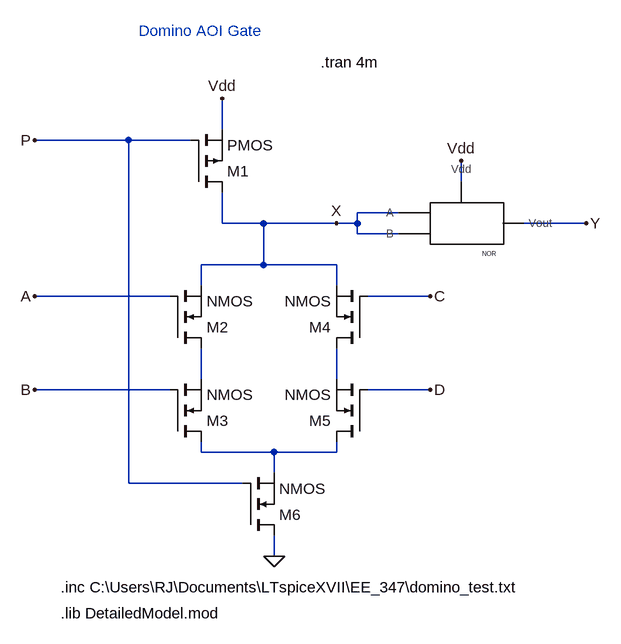
[diagram p0: schematic domino_aoi_gate.asc]
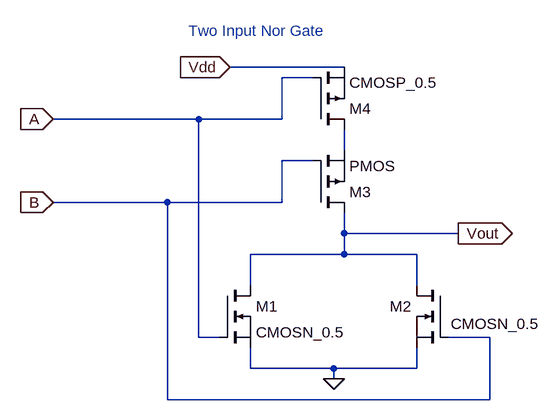
[diagram p1: sub-circuit my_nor.asc]
domino_aoi_gate.asc, the LTspice schematic file:
Version 4
SHEET 1 880 920
WIRE 256 160 256 112
WIRE 112 176 -32 176
WIRE 208 176 112 176
WIRE 624 240 624 208
WIRE 528 288 464 288
WIRE 256 304 256 256
WIRE 320 304 256 304
WIRE 432 304 320 304
WIRE 464 304 464 288
WIRE 464 304 432 304
WIRE 816 304 720 304
WIRE 464 320 464 304
WIRE 528 320 464 320
WIRE 320 368 320 304
WIRE 320 368 224 368
WIRE 432 368 320 368
WIRE 224 400 224 368
WIRE 432 400 432 368
WIRE 176 416 -32 416
WIRE 576 416 480 416
WIRE 224 544 224 496
WIRE 432 544 432 496
WIRE 176 560 -32 560
WIRE 576 560 480 560
WIRE 224 656 224 640
WIRE 336 656 224 656
WIRE 432 656 432 640
WIRE 432 656 336 656
WIRE 336 688 336 656
WIRE 112 704 112 176
WIRE 288 704 112 704
WIRE 336 816 336 784
FLAG -32 416 A
FLAG -32 560 B
FLAG 576 416 C
FLAG 576 560 D
FLAG 336 816 0
FLAG 432 304 X
FLAG 256 112 Vdd
FLAG -32 176 P
FLAG 624 208 Vdd
FLAG 816 304 Y
SYMBOL pmos 208 256 M180
SYMATTR InstName M1
SYMBOL nmos 176 496 M180
SYMATTR InstName M2
SYMBOL nmos 176 640 M180
SYMATTR InstName M3
SYMBOL nmos 480 496 R180
SYMATTR InstName M4
SYMBOL nmos 480 640 R180
SYMATTR InstName M5
SYMBOL nmos 288 784 M180
SYMATTR InstName M6
SYMBOL my_nor 624 304 R0
SYMATTR InstName NOR
TEXT 128 8 Left 2 ;Domino AOI Gate
TEXT 8 864 Left 2 !.inc C:\\Users\\RJ\\Documents\\LTspiceXVII\\EE_347\\domino_test.txt
TEXT 8 904 Left 2 !.lib DetailedModel.mod
TEXT 408 56 Left 2 !.tran 4m

my_nor.asc, the sub-circuit schematic file:
Version 4
SHEET 1 880 680
WIRE 336 -240 160 -240
WIRE 288 -224 240 -224
WIRE 112 -160 -112 -160
WIRE 240 -160 240 -224
WIRE 240 -160 112 -160
WIRE 336 -112 336 -144
WIRE 288 -96 240 -96
WIRE 64 -32 -112 -32
WIRE 240 -32 240 -96
WIRE 240 -32 64 -32
WIRE 336 16 336 -16
WIRE 512 16 336 16
WIRE 336 48 336 16
WIRE 336 48 192 48
WIRE 448 48 336 48
WIRE 192 96 192 48
WIRE 448 96 448 48
WIRE 112 176 112 -160
WIRE 144 176 112 176
WIRE 560 176 496 176
WIRE 192 224 192 192
WIRE 320 224 192 224
WIRE 448 224 448 192
WIRE 448 224 320 224
WIRE 320 240 320 224
WIRE 64 272 64 -32
WIRE 560 272 560 176
WIRE 560 272 64 272
FLAG -112 -32 B
IOPIN -112 -32 In
FLAG -112 -160 A
IOPIN -112 -160 In
FLAG 160 -240 Vdd
IOPIN 160 -240 In
FLAG 512 16 Vout
IOPIN 512 16 Out
FLAG 320 240 0
SYMBOL nmos 144 96 R0
SYMATTR InstName M1
SYMATTR Value CMOSN_0.5
SYMBOL nmos 496 96 M0
WINDOW 3 -141 59 Left 2
SYMATTR Value CMOSN_0.5
SYMATTR InstName M2
SYMBOL pmos 288 -144 M180
SYMATTR InstName M4
SYMATTR Value CMOSP_0.5
SYMBOL pmos 288 -16 M180
SYMATTR InstName M3
TEXT 96 -296 Left 2 ;Two Input Nor Gate

The netlist it stands for:
* domino_aoi_gate.asc
M1 X P Vdd Vdd PMOS
M2 N001 A X X NMOS
M3 N003 B N001 N001 NMOS
M4 N002 C X X NMOS
M5 N003 D N002 N002 NMOS
M6 0 P N003 N003 NMOS
XNOR X X Y Vdd my_nor

* block symbol definitions
.subckt my_nor A B Vout Vdd
M1 Vout A 0 0 CMOSN_0.5
M2 Vout B 0 0 CMOSN_0.5
M4 N001 A Vdd Vdd CMOSP_0.5
M3 Vout B N001 N001 PMOS
* Two Input Nor Gate
.ends my_nor

.model NMOS NMOS
.model PMOS PMOS
.lib standard.mos
* Domino AOI Gate
.inc C:\Users\RJ\Documents\LTspiceXVII\EE_347\domino_test.txt
.lib DetailedModel.mod
.tran 4m
.backanno
.end